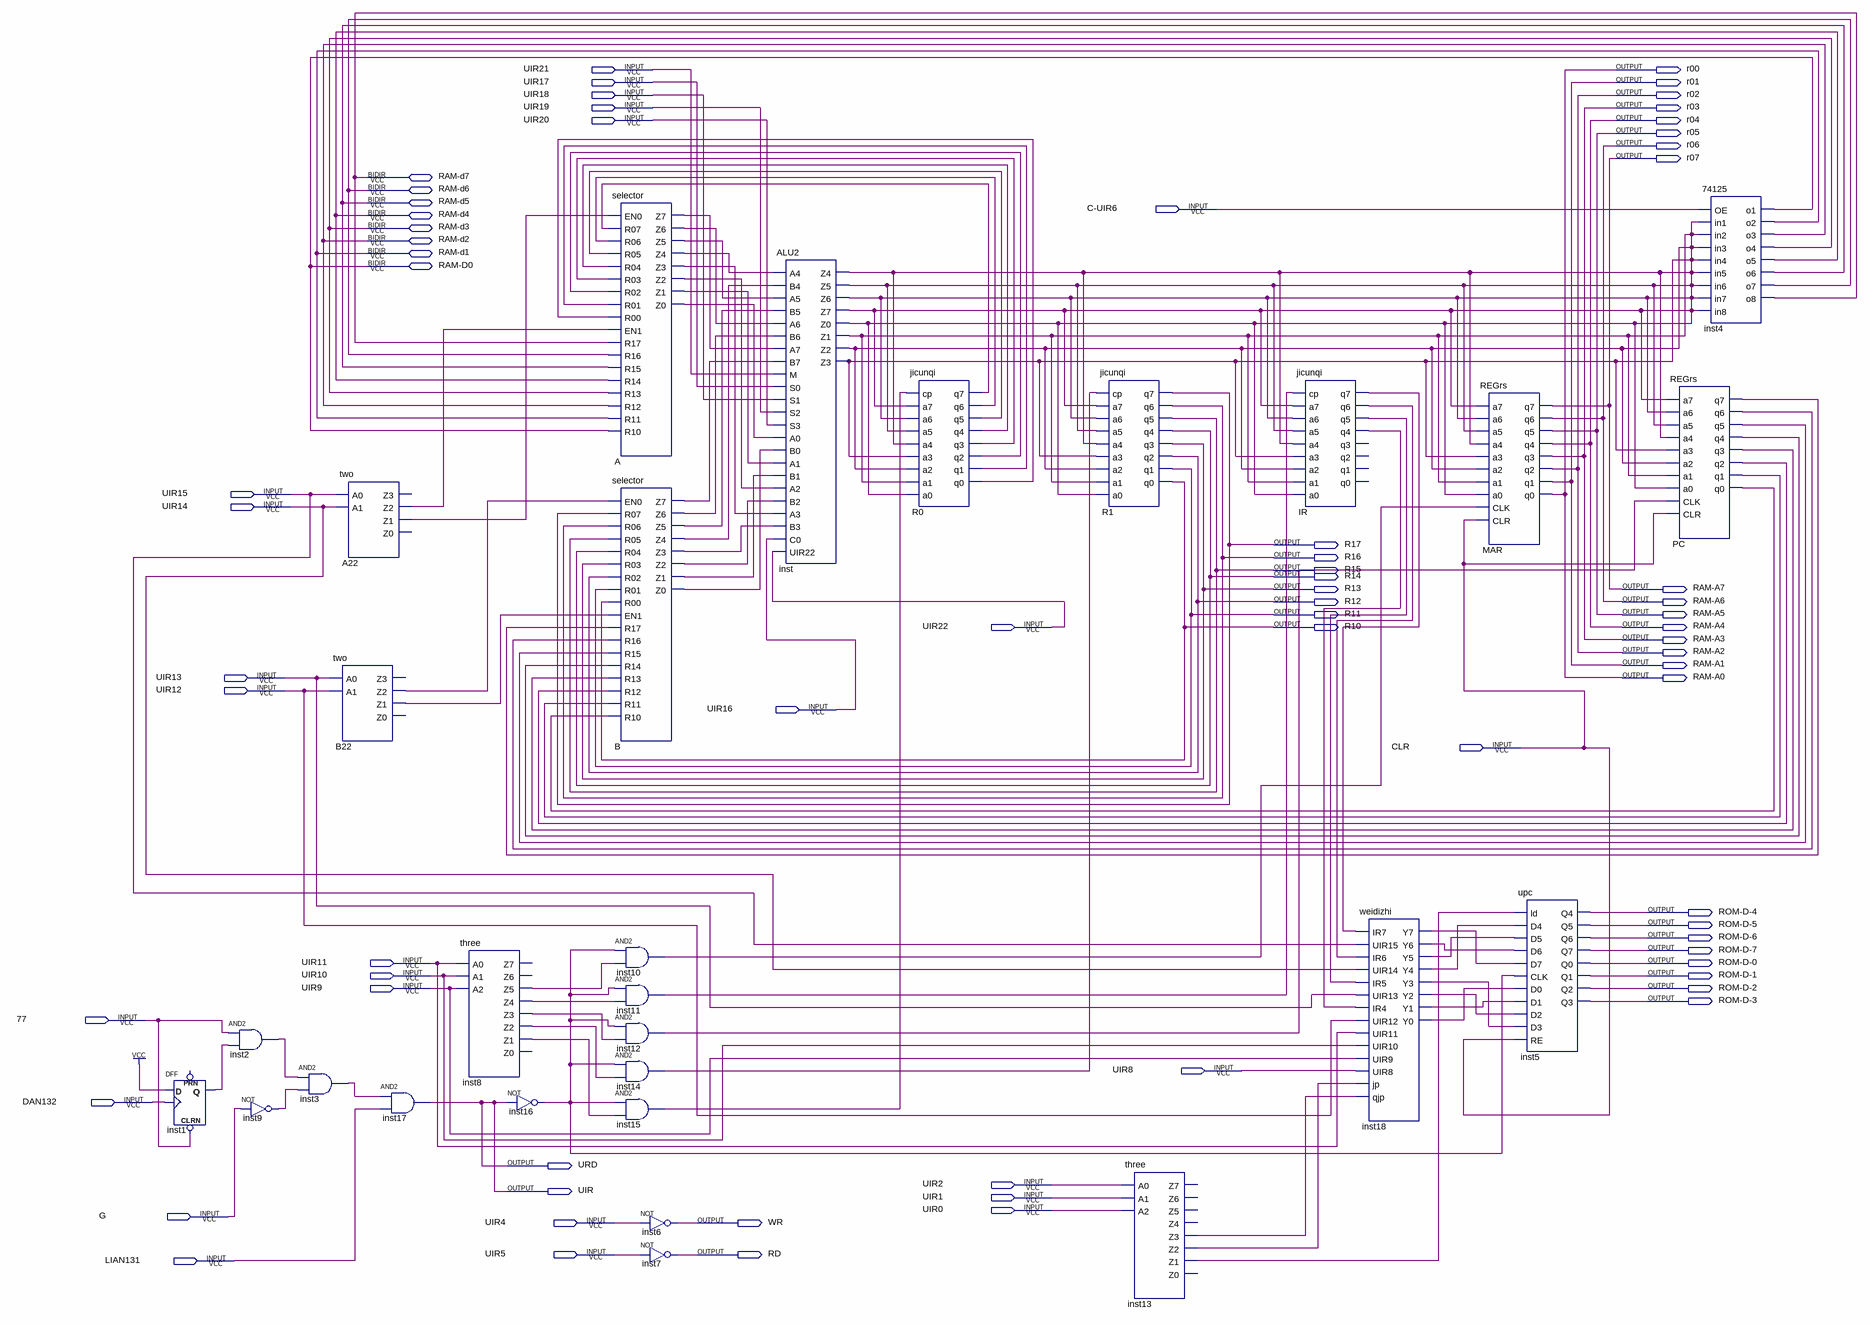
[diagram p0: schematic sheet]
// Quartus schematic test3.bdf as structural Verilog: 28 symbols, 70 pins
module test3 (
  input  UIR21,
  input  UIR17,
  input  UIR18,
  input  UIR19,
  input  UIR20,
  input  \C-UIR6 ,
  input  UIR15,
  input  UIR14,
  input  UIR22,
  input  UIR13,
  input  UIR12,
  input  UIR16,
  input  CLR,
  input  UIR11,
  input  UIR10,
  input  UIR9,
  input  \77 ,
  input  UIR8,
  input  DAN132,
  input  UIR2,
  input  UIR1,
  input  UIR0,
  input  G,
  input  UIR4,
  input  UIR5,
  input  LIAN131,
  inout  \RAM-d7 ,
  inout  \RAM-d6 ,
  inout  \RAM-d5 ,
  inout  \RAM-d4 ,
  inout  \RAM-d3 ,
  inout  \RAM-d2 ,
  inout  \RAM-d1 ,
  inout  \RAM-D0 ,
  output r00,
  output r01,
  output r02,
  output r03,
  output r04,
  output r05,
  output r06,
  output r07,
  output R17,
  output R16,
  output R15,
  output R14,
  output R13,
  output \RAM-A7 ,
  output R12,
  output \RAM-A6 ,
  output R11,
  output \RAM-A5 ,
  output R10,
  output \RAM-A4 ,
  output \RAM-A3 ,
  output \RAM-A2 ,
  output \RAM-A1 ,
  output \RAM-A0 ,
  output \ROM-D-4 ,
  output \ROM-D-5 ,
  output \ROM-D-6 ,
  output \ROM-D-7 ,
  output \ROM-D-0 ,
  output \ROM-D-1 ,
  output \ROM-D-2 ,
  output \ROM-D-3 ,
  output URD,
  output UIR,
  output WR,
  output RD
);

  wire A22_z1, A22_z2, A_z0, A_z1, A_z2, A_z3, A_z4, A_z5, A_z6, A_z7, B22_z1, B22_z2, B_z0, B_z1, B_z2,
       B_z3, B_z4, B_z5, B_z6, B_z7, inst1_q, inst2_out, inst3_out, inst8_z1, inst8_z2, inst8_z3, inst8_z4,
       inst8_z5, inst9_out, inst10_out, inst11_out, inst12_out, inst13_z1, inst13_z2, inst13_z3, inst14_out,
       inst15_out, inst16_out, inst18_y0, inst18_y1, inst18_y2, inst18_y3, inst18_y4, inst18_y5, inst18_y6,
       inst18_y7, inst_z4, IR_q4, IR_q5, IR_q6, IR_q7, PC_q0, PC_q1, PC_q2, PC_q3, PC_q4, PC_q5, PC_q6,
       PC_q7, R0_q0, R0_q1, R0_q2, R0_q3, R0_q4, R0_q5, R0_q6, R0_q7;

  DFF inst1 (.CLRN(\77 ), .CLK(DAN132), .D(1'b1), .Q(inst1_q));  // open: PRN
  and inst2 (inst2_out, \77 , inst1_q);
  not inst9 (inst9_out, G);
  two A22 (.A0(UIR15), .A1(UIR14), .Z2(A22_z2), .Z1(A22_z1));  // open: Z3, Z0
  two B22 (.A0(UIR13), .A1(UIR12), .Z2(B22_z2), .Z1(B22_z1));  // open: Z3, Z0
  and inst3 (inst3_out, inst2_out, inst9_out);
  and inst17 (UIR, inst3_out, LIAN131);
  three inst8 (
    .A0(UIR11), .A1(UIR10), .A2(UIR9), .Z5(inst8_z5), .Z4(inst8_z4), .Z3(inst8_z3), .Z2(inst8_z2),
    .Z1(inst8_z1));  // open: Z7, Z6, Z0
  not inst16 (inst16_out, UIR);
  selector A (
    .EN0(A22_z1), .R07(R0_q7), .R06(R0_q6), .R05(R0_q5), .R04(R0_q4), .R03(R0_q3), .R02(R0_q2), .R01(R0_q1),
    .R00(R0_q0), .EN1(A22_z2), .R17(\RAM-d7 ), .R16(\RAM-d6 ), .R15(\RAM-d5 ), .R14(\RAM-d4 ),
    .R13(\RAM-d3 ), .R12(\RAM-d2 ), .R11(\RAM-d1 ), .R10(\RAM-D0 ), .Z7(A_z7), .Z6(A_z6), .Z5(A_z5),
    .Z4(A_z4), .Z3(A_z3), .Z2(A_z2), .Z1(A_z1), .Z0(A_z0));
  selector B (
    .EN0(B22_z2), .R07(R17), .R06(R16), .R05(R15), .R04(R14), .R03(R13), .R02(R12), .R01(R11), .R00(R10),
    .EN1(B22_z1), .R17(PC_q7), .R16(PC_q6), .R15(PC_q5), .R14(PC_q4), .R13(PC_q3), .R12(PC_q2), .R11(PC_q1),
    .R10(PC_q0), .Z7(B_z7), .Z6(B_z6), .Z5(B_z5), .Z4(B_z4), .Z3(B_z3), .Z2(B_z2), .Z1(B_z1), .Z0(B_z0));
  and inst10 (inst10_out, inst16_out, inst8_z5);
  and inst11 (inst11_out, inst16_out, inst8_z4);
  and inst12 (inst12_out, inst16_out, inst8_z3);
  and inst14 (inst14_out, inst16_out, inst8_z2);
  and inst15 (inst15_out, inst16_out, inst8_z1);
  not inst6 (WR, UIR4);
  not inst7 (RD, UIR5);
  ALU2 inst (
    .A4(A_z4), .B4(B_z4), .A5(A_z5), .B5(B_z5), .A6(A_z6), .B6(B_z6), .A7(A_z7), .B7(B_z7), .M(UIR21),
    .S0(UIR17), .S1(UIR18), .S2(UIR19), .S3(UIR20), .A0(A_z0), .B0(B_z0), .A1(A_z1), .B1(B_z1), .A2(A_z2),
    .B2(B_z2), .A3(A_z3), .B3(B_z3), .C0(UIR16), .UIR22(UIR22), .Z4(inst_z4), .Z5(inst_z4), .Z6(inst_z4),
    .Z7(inst_z4), .Z0(inst_z4), .Z1(inst_z4), .Z2(inst_z4), .Z3(inst_z4));
  jicunqi R0 (
    .cp(inst15_out), .a7(inst_z4), .a6(inst_z4), .a5(inst_z4), .a4(inst_z4), .a3(inst_z4), .a2(inst_z4),
    .a1(inst_z4), .a0(inst_z4), .q7(R0_q7), .q6(R0_q6), .q5(R0_q5), .q4(R0_q4), .q3(R0_q3), .q2(R0_q2),
    .q1(R0_q1), .q0(R0_q0));
  jicunqi R1 (
    .cp(inst14_out), .a7(inst_z4), .a6(inst_z4), .a5(inst_z4), .a4(inst_z4), .a3(inst_z4), .a2(inst_z4),
    .a1(inst_z4), .a0(inst_z4), .q7(R17), .q6(R16), .q5(R15), .q4(R14), .q3(R13), .q2(R12), .q1(R11), .q0(R10));
  three inst13 (
    .A0(UIR2), .A1(UIR1), .A2(UIR0), .Z3(inst13_z3), .Z2(inst13_z2), .Z1(inst13_z1));  // open: Z7, Z6, Z5, Z4, Z0
  jicunqi IR (
    .cp(inst11_out), .a7(inst_z4), .a6(inst_z4), .a5(inst_z4), .a4(inst_z4), .a3(inst_z4), .a2(inst_z4),
    .a1(inst_z4), .a0(inst_z4), .q7(IR_q7), .q6(IR_q6), .q5(IR_q5), .q4(IR_q4));  // open: q3, q2, q1, q0
  weidizhi inst18 (
    .IR7(IR_q7), .UIR15(UIR15), .IR6(IR_q6), .UIR14(UIR14), .IR5(IR_q5), .UIR13(UIR13), .IR4(IR_q4),
    .UIR12(UIR12), .UIR11(UIR11), .UIR10(UIR10), .UIR9(UIR9), .UIR8(UIR8), .jp(inst13_z2), .qjp(inst13_z3),
    .Y7(inst18_y7), .Y6(inst18_y6), .Y5(inst18_y5), .Y4(inst18_y4), .Y3(inst18_y3), .Y2(inst18_y2),
    .Y1(inst18_y1), .Y0(inst18_y0));
  REGrs MAR (
    .a7(inst_z4), .a6(inst_z4), .a5(inst_z4), .a4(inst_z4), .a3(inst_z4), .a2(inst_z4), .a1(inst_z4),
    .a0(inst_z4), .CLK(inst10_out), .CLR(CLR), .q7(r07), .q6(r06), .q5(r05), .q4(r04), .q3(r03), .q2(r02),
    .q1(r01), .q0(r00));
  upc inst5 (
    .ld(inst13_z1), .D4(inst18_y4), .D5(inst18_y5), .D6(inst18_y6), .D7(inst18_y7), .CLK(inst16_out),
    .D0(inst18_y0), .D1(inst18_y1), .D2(inst18_y2), .D3(inst18_y3), .RE(CLR), .Q4(\ROM-D-4 ), .Q5(\ROM-D-5 ),
    .Q6(\ROM-D-6 ), .Q7(\ROM-D-7 ), .Q0(\ROM-D-0 ), .Q1(\ROM-D-1 ), .Q2(\ROM-D-2 ), .Q3(\ROM-D-3 ));
  \74125  inst4 (
    .OE(\C-UIR6 ), .in1(inst_z4), .in2(inst_z4), .in3(inst_z4), .in4(inst_z4), .in5(inst_z4), .in6(inst_z4),
    .in7(inst_z4), .in8(inst_z4), .o1(\RAM-D0 ), .o2(\RAM-d1 ), .o3(\RAM-d2 ), .o4(\RAM-d3 ), .o5(\RAM-d4 ),
    .o6(\RAM-d5 ), .o7(\RAM-d6 ), .o8(\RAM-d7 ));
  REGrs PC (
    .a7(inst_z4), .a6(inst_z4), .a5(inst_z4), .a4(inst_z4), .a3(inst_z4), .a2(inst_z4), .a1(inst_z4),
    .a0(inst_z4), .CLK(inst12_out), .CLR(CLR), .q7(PC_q7), .q6(PC_q6), .q5(PC_q5), .q4(PC_q4), .q3(PC_q3),
    .q2(PC_q2), .q1(PC_q1), .q0(PC_q0));

  assign \RAM-A0  = r00;
  assign \RAM-A1  = r01;
  assign \RAM-A2  = r02;
  assign \RAM-A3  = r03;
  assign \RAM-A4  = r04;
  assign \RAM-A5  = r05;
  assign \RAM-A6  = r06;
  assign \RAM-A7  = r07;
  assign URD = UIR;
endmodule
